# Altium schematic sheet ST_LINK.SCHDOC
size A4; Revision: B.2
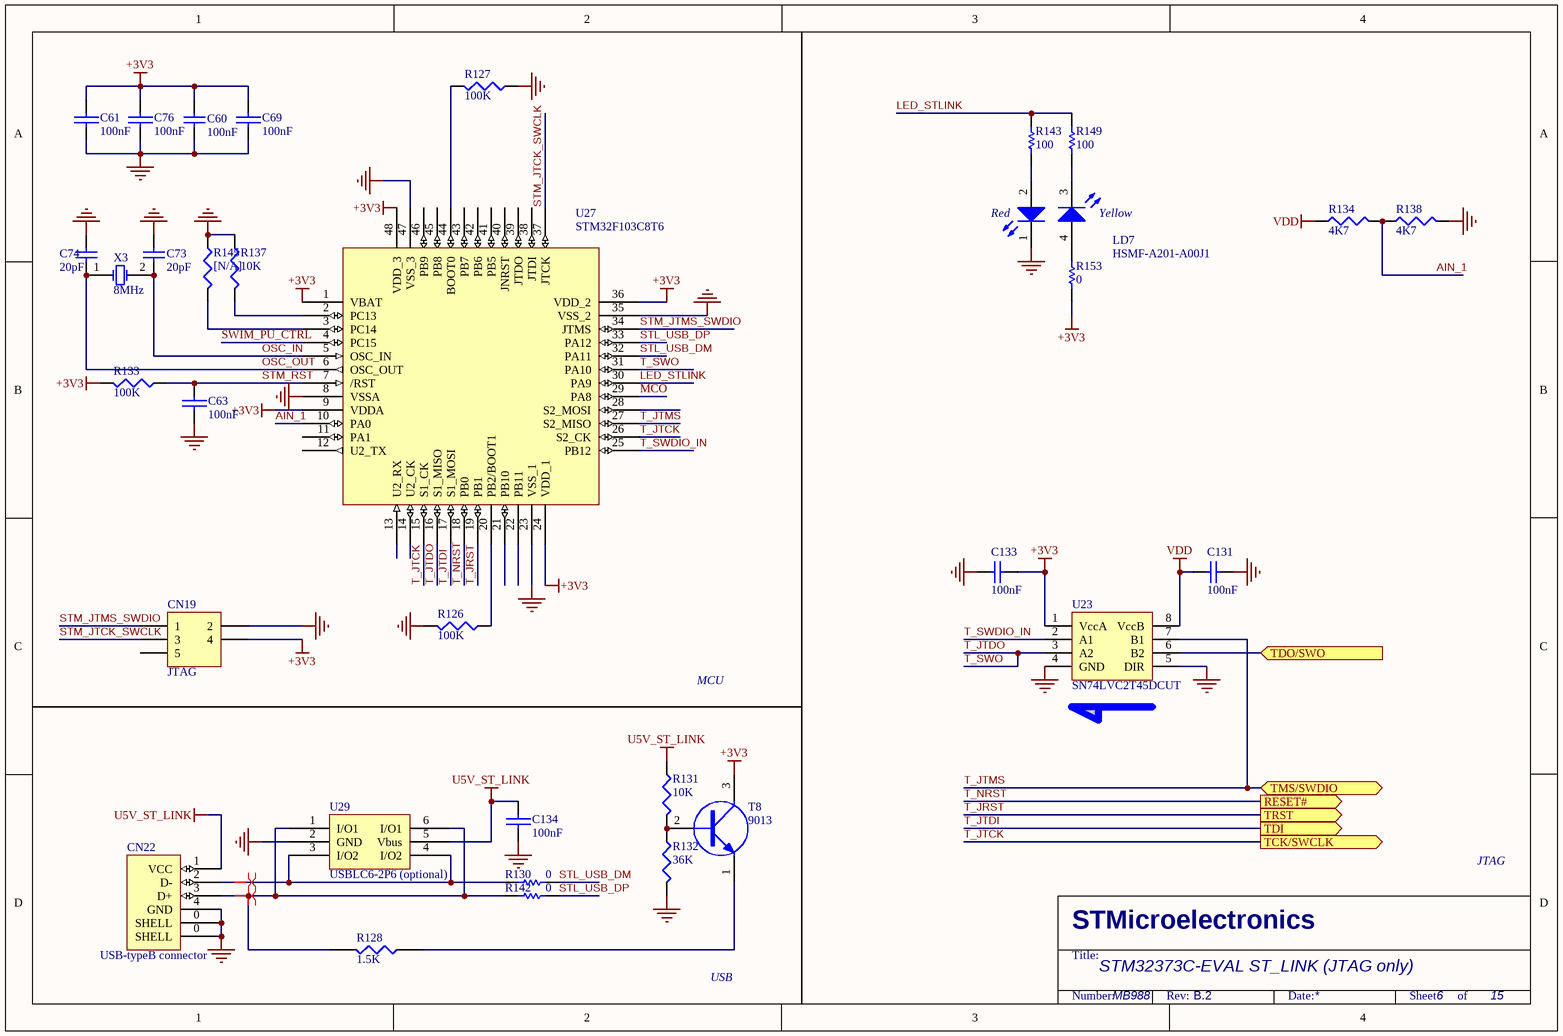
[diagram p0: ST_LINK.SCHDOC]

## Parts
C60  100nF  [0603C]
C61  100nF  [0603C]
C63  100nF  [0603C]
C69  100nF  [0603C]
C73  value 20pF  [0603R]  (hidden comment: Cap)
C74  value 20pF  [0603R]  (hidden comment: Cap)
C76  100nF  [0603C]
C131  100nF  [0603C]
C133  100nF  [0603C]
C134  100nF  [0603C]
CN19  JTAG  [2*3P]
CN22  USB-typeB connector  [USB-B]
LD7  HSMF-A201-A00J1  [LED2-28*32]
R126  100K  [0603R]
R127  100K  [0603R]
R128  1.5K  [0603R]
R130  0  [0603R]
R131  10K  [0603R]
R132  36K  [0603R]
R133  100K  [0603R]
R134  4K7  [0603R]
R137  10K  [0603R]
R138  4K7  [0603R]
R142  0  [0603R]
R143  100  [0603R]
R145  [N/A]  [0603R]
R149  100  [0603R]
R153  0  [0603R]
T8  9013  [SOT-23]
U23  SN74LVC2T45DCUT  [VSSOP8]
U27  STM32F103C8T6  [LQFP48]
U29  USBLC6-2P6 (optional)  [SOT-666]
X3  8MHz  [SMT_XTAL]

## Ports
RESET# (out), TCK/SWCLK (out), TDI (out), TDO/SWO (in), TMS/SWDIO (bidir), TRST (out)

## Nets
+3V3: C60.1 C61.2 C69.2 C76.2 C133.2 CN19.4 R133.2 R153.2 T8.3(C) U23.1(VccA) U27.1(VBAT) U27.9(VDDA) U27.24(VDD_1) U27.36(VDD_2) U27.48(VDD_3)
GND: C60.2 C61.1 C63.1 C69.1 C73.1 C74.1 C76.1 C131.2 C133.1 C134.2 CN19.2 CN22.0(SHELL) CN22.4(GND) LD7.1(RED_cathode) R126.2 R127.1 R132.2 R137.1 R138.2 R145.1 U23.4(GND) U23.5(DIR) U27.8(VSSA) U27.23(VSS_1) U27.35(VSS_2) U27.47(VSS_3) U29.2(GND)
U5V_ST_LINK: C134.1 CN22.1(VCC) R131.1 U29.5(Vbus)
VDD: C131.1 R134.1 U23.8(VccB)
AIN_1: R134.2 R138.1 U27.10(PA0)
LED_STLINK: R143.1 R149.1 U27.30(PA9)
MCO: U27.29(PA8)
OSC_IN: C73.2 U27.5(OSC_IN) X3.2(OSC2)
OSC_OUT: C74.2 U27.6(OSC_OUT) X3.1(OSC1)
STL_USB_DM: R130.1 U27.32(PA11)
STL_USB_DP: R142.1 U27.33(PA12)
STM_JTCK_SWCLK: CN19.3 U27.37(JTCK)
STM_JTMS_SWDIO: CN19.1 U27.34(JTMS)
STM_RST: C63.2 R133.1 U27.7(/RST)
SWIM_PU_CTRL: U27.4(PC15)
T_JRST: U27.19(PB1) ; port TRST
T_JTCK: U27.15(S1_CK) U27.26(S2_CK) ; port TCK/SWCLK
T_JTDI: U27.17(S1_MOSI) ; port TDI
T_JTDO: U23.3(A2) U27.16(S1_MISO) U27.31(PA10)  [also labelled T_SWO]
T_JTMS: U23.7(B1) U27.27(S2_MISO) ; port TMS/SWDIO
T_NRST: U27.18(PB0) ; port RESET#
T_SWDIO_IN: U23.2(A1) U27.25(PB12)
TDO/SWO: U23.6(B2) ; port TDO/SWO
NetCN22_2: CN22.2(D-) R130.2 U29.3(I/O2) U29.4(I/O2)
NetCN22_3: CN22.3(D+) R128.2 R142.2 U29.1(I/O1) U29.6(I/O1)
NetLD7_2: LD7.2(Red_anode) R143.2
NetLD7_3: LD7.3(YellowGreen_cathode) R149.2
NetLD7_4: LD7.4(YellowGreen_anode) R153.1
NetR126_1: R126.1 U27.20(PB2/BOOT1)
NetR127_2: R127.2 U27.44(BOOT0)
NetR128_1: R128.1 T8.1(E)
NetR131_2: R131.2 R132.1 T8.2(B)
NetR137_2: R137.2 U27.2(PC13)
NetR145_2: R145.2 U27.3(PC14)

Not connected (* = marked no-connect by the designer): CN19 5; U27 11(PA1) 12(U2_TX) 13(U2_RX) 14(U2_CK) 21(PB10) 22(PB11) 28(S2_MOSI) 38(JTDI) 39(JTDO) 40(JNRST) 41(PB5) 42(PB6) 43(PB7) 45(PB8) 46(PB9)

## Layout directives
differential pair: NetCN22_2, NetCN22_3

## Notes on the sheet
- MCU
- JTAG
- USB
- STM32373C-EVAL ST_LINK (JTAG only)
- MB988
- 6
- 15
- STMicroelectronics
- Title:
- Number:
- Rev:
- Date:
- Sheet       of
- (in symbol HSMF-A201-A00J1) Red; Yellow

## Library data of the parts
C60 = Cap: Capacitor; Value: 10nF; Published: 8-Jun-2000; Revision: July-2002: Re-released for DXP Platform.; Publisher: Altium Limited
C61 C63 C69 C76 = CAP
C73 C74 = Cap: Capacitor; Published: 8-Jun-2000; LatestRevisionDate: 17-Jul-2002; LatestRevisionNote: Re-released for DXP Platform.; PackageReference: RAD-0.3; Publisher: Altium Limited
C131 C133 = CAP: Capacitor; Value: 100pF; Published: 8-Jun-2000; Revision: July-2002: Re-released for DXP Platform.; Publisher: Altium Limited
C134 = CAP: Capacitor
CN19 = Header 3X2: Header, 3-Pin, Dual row; Revision: 17-Jul-2002: Re-released for DXP Platform.; Publisher: Altium Limited
R126-R128 R133 R134 R138 = RES1
R130 R142 R143 R149 R153 = Res1: Resistor; Value: 1K; Published: 8-Jun-2000; Revision: July-2002: Re-released for DXP Platform.; Publisher: Altium Limited
R131 R132 R137 R145 = R: Right: 20; Bottom: 30
T8 = NPN
U27 = STM32F10x(48pin)
U29 = USBLC6-2
X3 = XTAL: Crystal Oscillator; Published: 8-Jun-2000; LatestRevisionDate: 17-Jul-2002; LatestRevisionNote: Re-released for DXP Platform.; PackageReference: R38; Publisher: Altium Limited